# Altium schematic sheet STlink_V3E_PWR.SchDoc: STLINK-V3E SWD Power Module
size A4; Date: Not used; ApprovedBy: Not used; CheckedBy: Not used; Author: Not used; CompanyName: STMicroelectronics; DrawnBy: Not used; Engineer: Not used; Organization: Not used; Address1: Not used; Address2: Not used; Address3: Not used; Address4: Not used; DocumentNumber: Not used; Revision: Not used; SheetNumber: 18; SheetTotal: 19; CurrentTime: Not used; CurrentDate: Not used; Time: Not used; DocumentFullPathAndName: Not used; DocumentName: Not used; ModifiedDate: Not used; ImagePath: Not used; ProjectName: Not used; Application_BuildNumber: Not used
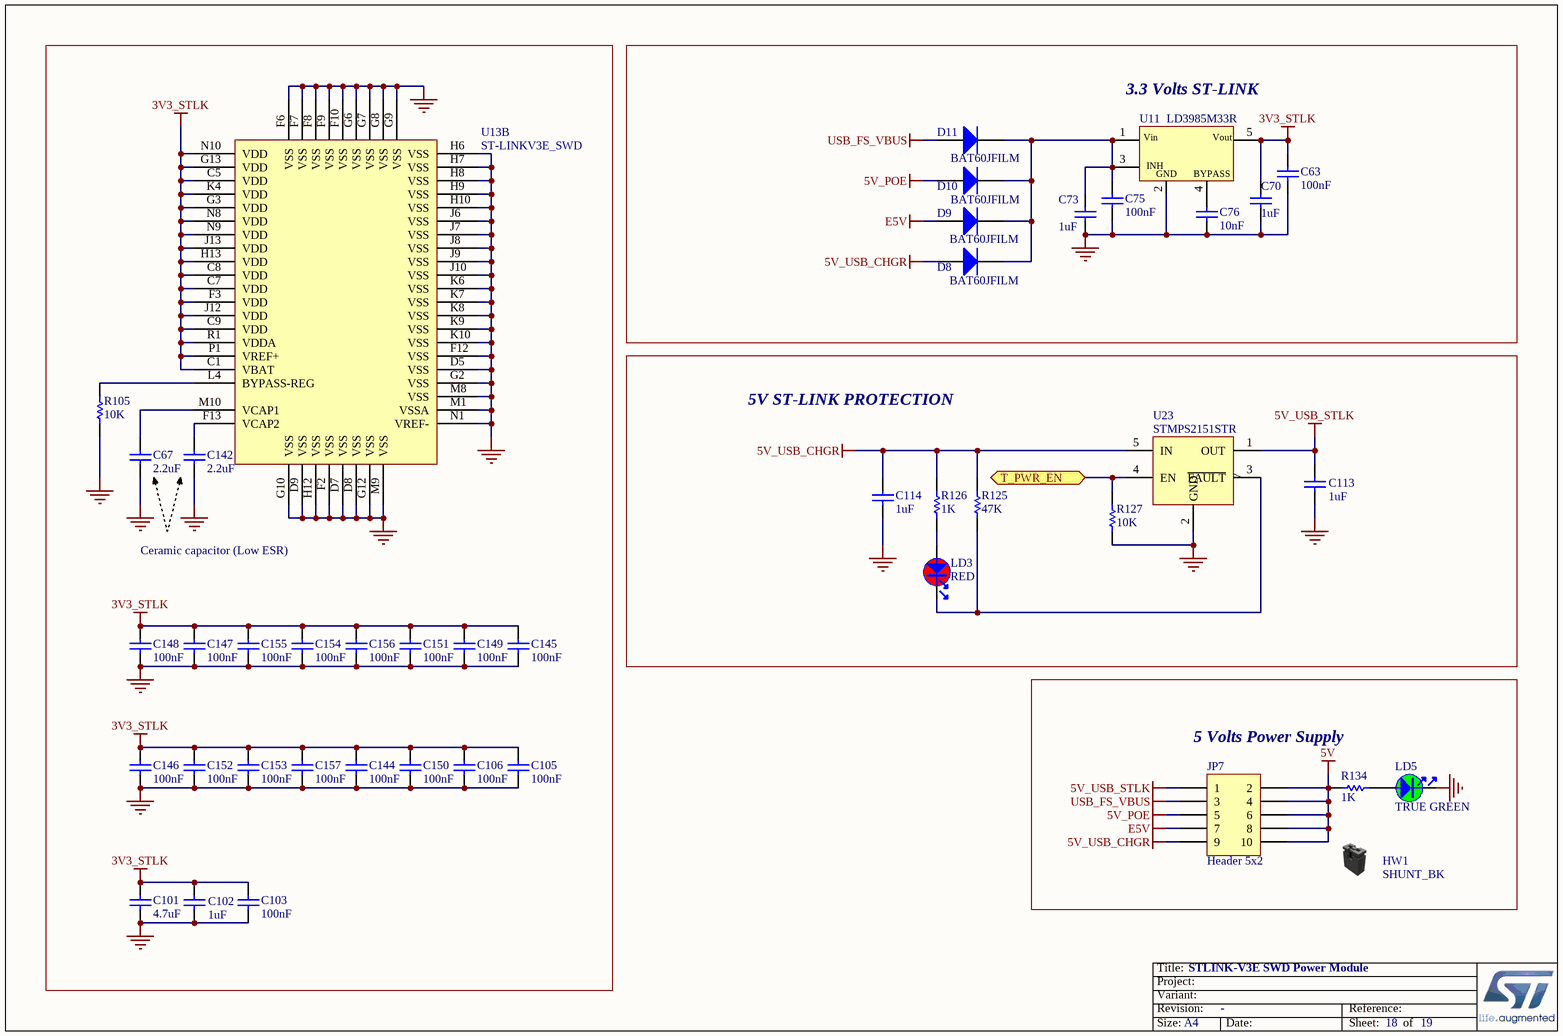
[diagram p0: STlink_V3E_PWR.SchDoc]

## Parts
C63  value 100nF  [C0402]  (hidden comment: Capacitor)
C67  value 2.2uF  [C1206_H1P15]  (hidden comment: Capacitor)
C70  value 1uF  [C0603]  (hidden comment: Capacitor)
C73  value 1uF  [C0603]  (hidden comment: Capacitor)
C75  value 100nF  [C0402]  (hidden comment: Capacitor)
C76  value 10nF  [C0402]  (hidden comment: Capacitor)
C101  value 4.7uF  [C0603]  (hidden comment: Capacitor)
C102  value 1uF  [C0603]  (hidden comment: Capacitor)
C103  value 100nF  [C0402]  (hidden comment: Capacitor)
C105  value 100nF  [C0402]  (hidden comment: Capacitor)
C106  value 100nF  [C0402]  (hidden comment: Capacitor)
C113  value 1uF  [C0603]  (hidden comment: Capacitor)
C114  value 1uF  [C0603]  (hidden comment: Capacitor)
C142  value 2.2uF  [C1206_H1P15]  (hidden comment: Capacitor)
C144  value 100nF  [C0402]  (hidden comment: Capacitor)
C145  value 100nF  [C0402]  (hidden comment: Capacitor)
C146  value 100nF  [C0402]  (hidden comment: Capacitor)
C147  value 100nF  [C0402]  (hidden comment: Capacitor)
C148  value 100nF  [C0402]  (hidden comment: Capacitor)
C149  value 100nF  [C0402]  (hidden comment: Capacitor)
C150  value 100nF  [C0402]  (hidden comment: Capacitor)
C151  value 100nF  [C0402]  (hidden comment: Capacitor)
C152  value 100nF  [C0402]  (hidden comment: Capacitor)
C153  value 100nF  [C0402]  (hidden comment: Capacitor)
C154  value 100nF  [C0402]  (hidden comment: Capacitor)
C155  value 100nF  [C0402]  (hidden comment: Capacitor)
C156  value 100nF  [C0402]  (hidden comment: Capacitor)
C157  value 100nF  [C0402]  (hidden comment: Capacitor)
D8  BAT60JFILM  [DIO_SOD323]
D9  BAT60JFILM  [DIO_SOD323]
D10  BAT60JFILM  [DIO_SOD323]
D11  BAT60JFILM  [DIO_SOD323]
HW1  value SHUNT_BK  [NA]  (hidden comment: Shunt Black 2.54mm)  (mechanical)
JP7  Header 5x2  [CON_988-JIUBABA_PHFS25-12-10-G0B115-T-1]
LD3  value RED  [LED_0603_VISHAY_VLMS1300-GS08_RED_1A2K_H0P8]  (hidden comment: LED_red)
LD5  value TRUE GREEN  [LED_0603_VISHAY_VLMTG1300-GS08_GREEN_1A2K_H0P8]  (hidden comment: LED_green)
R105  value 10K  [R0402]  (hidden comment: Resistor)
R125  value 47K  [R0402]  (hidden comment: Resistor)
R126  value 1K  [R0402]  (hidden comment: Resistor)
R127  value 10K  [R0402]  (hidden comment: Resistor)
R134  value 1K  [R0603]  (hidden comment: Resistor)
U11  LD3985M33R  [REG_SOT23-5L]
U13  ST-LINKV3E_SWD  [ICC_UFBGA201_176+25_10X10_P065]  (part B of 2)
U23  STMPS2151STR  [MOS_SOT23-5L]

## Blocks framed on the sheet
Ceramic capacitor (Low ESR): C67 C101-C103 C105 C106 C142 C144-C157 R105 U13
3.3 Volts ST-LINK: C63 C70 C73 C75 C76 D8-D11 U11
5V ST-LINK PROTECTION: C113 C114 LD3 R125-R127 U23
5 Volts Power Supply: HW1 JP7 LD5 R134

## Ports
T_PWR_EN

## Nets
3V3_STLK: C63.2 C70.2 C101.2 C102.2 C103.2 C105.2 C106.2 C144.2 C145.2 C146.2 C147.2 C148.2 C149.2 C150.2 C151.2 C152.2 C153.2 C154.2 C155.2 C156.2 C157.2 U11.5(Vout) U13.C1(VBAT) U13.C5(VDD) U13.C7(VDD) U13.C8(VDD) U13.C9(VDD) U13.F3(VDD) U13.G3(VDD) U13.G13(VDD) U13.H13(VDD) U13.J12(VDD) U13.J13(VDD) U13.K4(VDD) U13.N8(VDD) U13.N9(VDD) U13.N10(VDD) U13.P1(VREF+) U13.R1(VDDA)
5V: JP7.2 JP7.4 JP7.6 JP7.8 JP7.10 R134.1
5V_POE: D10.1(A) JP7.5
5V_USB_CHGR: C114.2 D8.1(A) JP7.9 R125.2 R126.2 U23.5(IN)
5V_USB_STLK: C113.2 JP7.1 U23.1(OUT)
E5V: D9.1(A) JP7.7
GND: C63.1 C67.1 C70.1 C73.2 C75.1 C76.1 C101.1 C102.1 C103.1 C105.1 C106.1 C113.1 C114.1 C142.1 C144.1 C145.1 C146.1 C147.1 C148.1 C149.1 C150.1 C151.1 C152.1 C153.1 C154.1 C155.1 C156.1 C157.1 LD5.2 R105.1 R127.2 U11.2(GND) U13.D5(VSS) U13.D7(VSS) U13.D8(VSS) U13.D9(VSS) U13.F2(VSS) U13.F6(VSS) U13.F7(VSS) U13.F8(VSS) U13.F9(VSS) U13.F10(VSS) U13.F12(VSS) U13.G2(VSS) U13.G6(VSS) U13.G7(VSS) U13.G8(VSS) U13.G9(VSS) U13.G10(VSS) U13.G12(VSS) U13.H6(VSS) U13.H7(VSS) U13.H8(VSS) U13.H9(VSS) U13.H10(VSS) U13.H12(VSS) U13.J6(VSS) U13.J7(VSS) U13.J8(VSS) U13.J9(VSS) U13.J10(VSS) U13.K6(VSS) U13.K7(VSS) U13.K8(VSS) U13.K9(VSS) U13.K10(VSS) U13.M1(VSSA) U13.M8(VSS) U13.M9(VSS) U13.N1(VREF-) U23.2(GND)
USB_FS_VBUS: D11.1(A) JP7.3
T_PWR_EN: R127.1 U23.4(EN) ; port T_PWR_EN
NetC67_2: C67.2 U13.M10(VCAP1)
NetC73_1: C73.1 C75.2 D8.2(K) D9.2(K) D10.2(K) D11.2(K) U11.1(Vin) U11.3(CE)
NetC76_2: C76.2 U11.4(BYPASS)
NetC142_2: C142.2 U13.F13(VCAP2)
NetLD3_1: LD3.1 R126.1
NetLD3_2: LD3.2 R125.1 U23.3(~{FAULT})
NetLD5_1: LD5.1 R134.2
NetR105_2: R105.2 U13.L4(BYPASS-REG)

## Notes on the sheet
- Title:
- Project:
- Size:
- Revision:
- Variant:
- A4
- -
- Date:
- Reference:
- Sheet:
- of
- (in symbol MCD-00086) INH

## Library data of the parts
C63 C75 C103 C105 C106 C144-C157 = MCD-00102: Capacitor, MLCC, 100nF, 16V, X7R, 10%, 0402, T=0,5mm; Manufacturer_Part_Number: CC0402KRX7R7BB104; Manufacturer: YAGEO; Alternate_Manufacturer_Part_Number: GCM155R71C104KA55D; Alternate_Manufacturer: MURATA; Provided_By: SUBCO; Internal_Part_Number: MCD-00102; Status: Released; Package: C0402; ComponentLink1Description: Datasheet; Part_Type: Capacitor; ComponentLink1URL: http://tunmcdsvn.tun.st.com/Component_Datasheet_Library/Trunk/Capacitors/Yageo_Multilayer_Capacitor_X7R_series_100pF_to_22uF
C67 C142 = MCD-00008: Capacitor, MLCC, 2.2uF, 16V, X7R, 10%, 1206, T=1,15mm; Manufacturer_Part_Number: CC1206KKX7R7BB225; Manufacturer: YAGEO; Alternate_Manufacturer_Part_Number: C1206C225K4RAC; Alternate_Manufacturer: KEMET; Provided_By: SUBCO; Internal_Part_Number: MCD-00008; Status: Released; Part_Type: Capacitor; Package: C1206; ComponentLink1Description: Datasheet; ComponentLink1URL: http://tunmcdsvn.tun.st.com/Component_Datasheet_Library/Trunk/Capacitors/Yageo_Multilayer_Capacitor_X7R_series_100pF_to_22uF
C70 C102 C113 C114 = MCD-00010: Capacitor, MLCC, 1uF, 16V, X5R, 10%, 0603, T=0,8mm; Manufacturer_Part_Number: CC0603KRX5R7BB105; Manufacturer: YAGEO; Provided_By: SUBCO; Internal_Part_Number: MCD-00010; Status: Released; Package: C0603; ComponentLink1Description: Datasheet; Part_Type: Capacitor; ComponentLink1URL: http://tunmcdsvn.tun.st.com/Component_Datasheet_Library/Trunk/Capacitors/Yageo_Multilayer_capacitor_X5R_series_100pF_to_100uF
C73 = MCD-00238: Capacitor, MLCC, 1uF, 6V3, X5R, 10%, 0603, T=0,8mm; Manufacturer_Part_Number: CC0603KRX5R5BB105; Manufacturer: YAGEO; Provided_By: SUBCO; Internal_Part_Number: MCD-00238; Status: Released; Part_Type: Capacitor; Package: C0603; ComponentLink1Description: Datasheet; ComponentLink1URL: http://tunmcdsvn.tun.st.com/Component_Datasheet_Library/Trunk/Capacitors/Yageo_Multilayer_capacitor_X5R_series_100pF_to_100uF
C76 = MCD-00011: Capacitor, MLCC, 10nF, 16V, X7R, 10%, 0402, T=0.5mm; Manufacturer_Part_Number: CC0402KRX7R7BB103; Manufacturer: YAGEO; Provided_By: SUBCO; Internal_Part_Number: MCD-00011; Status: Released; Part_Type: Capacitor; Package: C0402; ComponentLink1Description: Datasheet; ComponentLink1URL: http://tunmcdsvn.tun.st.com/Component_Datasheet_Library/Trunk/Capacitors/Yageo_Multilayer_Capacitor_X7R_series_100pF_to_22uF
C101 = MCD-00009: Capacitor, MLCC, 4.7uF, 16V, X5R, 10%, 0603, T=0.8mm; Manufacturer_Part_Number: CC0603KRX5R7BB475; Manufacturer: YAGEO; Provided_By: SUBCO; Internal_Part_Number: MCD-00009; Status: Released; Part_Type: Capacitor; Package: C0603; ComponentLink1Description: Datasheet; ComponentLink1URL: http://tunmcdsvn.tun.st.com/Component_Datasheet_Library/Trunk/Capacitors/Yageo_Multilayer_capacitor_X5R_series_100pF_to_100uF
D8-D11 = MCD-00034: Manufacturer: STMICROELECTRONICS; Part_Type: Diode; BMS_Part_Number: 9151097; Provided_By: SUBCO with ST control; Internal_Part_Number: MCD-00034; Value: BAT60JFILM; Status: Released; Manufacturer_Part_Number: BAT60JFILM; ComponentLink1Description: Datasheet; ComponentLink1URL: http://tunmcdsvn.tun.st.com/Component_Datasheet_Library/Trunk/Diodes/STM_Diode_BAT60JFILM-SOD323
HW1 = MCD-00122: SHUNT, 2.54mm, height 6.10mm, BLACK; Manufacturer_Part_Number: SNT-100-BK-G; Manufacturer: SAMTEC; Part_Type: Connector; Provided_By: SUBCO; Internal_Part_Number: MCD-00122; Status: Released; ComponentLink1Description: Datasheet; ComponentLink1URL: http://tunmcdsvn.tun.st.com/Component_Datasheet_Library/Trunk/Connectors/Samtec_Shunt_Jumper_SNT100
JP7 = MCD-00312: Header, 5x2, 2.54mm, VR, TH, Height 6mm/3mm; Part_Type: Connector; Manufacturer_Part_Number: PHFS25-12-10-G0B115-T-1; Manufacturer: JIUBABA; Provided_By: SUBCO; Internal_Part_Number: MCD-00312; Value: Header 5x2; Status: Released; ComponentLink1Description: Datasheet; ComponentLink1URL: http://tunmcdsvn.tun.st.com/Component_Datasheet_Library/Trunk/Connectors/Jiubaba_PHFS25_12XXXXXXXXX1; ECCN_US: n/a; ECCN_EU: n/a
LD3 = MCD-00587: LED Red, 0603 SMD, 2V Forward Voltage; Part_Type: Display; Manufacturer_Part_Number: VLMS1300-GS08; Manufacturer: VISHAY; Alternate_Manufacturer_Part_Number: LS Q976-NR-1; Alternate_Manufacturer: OSRAM OPTO SEMICONDUCTORS; Provided_By: SUBCO; Internal_Part_Number: MCD-00587; Status: Released; Package: LED 0603; ComponentLink1Description: Datasheet; ComponentLink1URL: http://tunmcdsvn.tun.st.com/Component_Datasheet_Library/Trunk/Display/VISHAY_LED_RED_VLMS1300-GS08; Order_Code_Digikey: VLMS1300-GS08CT-ND; Order_Code_Farnell: 2078728
LD5 = MCD-00589: LED Green, 0603 SMD, Fw Voltage = 2.8V - 3.6V; Part_Type: Display; Manufacturer_Part_Number: VLMTG1300-GS08; Manufacturer: VISHAY; Alternate_Manufacturer_Part_Number: LG Q396-PS-35; Alternate_Manufacturer: OSRAM OPTO SEMICONDUCTORS; Order_Code_RS: 7730452; Provided_By: SUBCO; Internal_Part_Number: MCD-00589; Status: Checked; Package: LED 0603; ComponentLink1Description: Datasheet; ComponentLink1URL: http://tunmcdsvn.tun.st.com/Component_Datasheet_Library/Trunk/Display/VISHAY_LED_GREEN_VLMTG1300-GS08; Order_Code_Digikey: VLMTG1300-GS08CT-ND; Order_Code_Farnell: 2251490
R105 R127 = MCD-00053: Resistor,10K,0402,1%,1/16W; Manufacturer_Part_Number: RC0402FR-0710KL; Manufacturer: YAGEO; Provided_By: SUBCO; Internal_Part_Number: MCD-00053; Status: Released; ComponentLink1Description: Datasheet; Part_Type: Resistor; Package: R0402; ComponentLink1URL: http://tunmcdsvn.tun.st.com/Component_Datasheet_Library/Trunk/Resistors/Yageo_Resistor_RC0402-series
R125 = MCD-00063: Resistor,47K,0402,1%,1/16W; Manufacturer_Part_Number: RC0402FR-0747KL; Manufacturer: YAGEO; Provided_By: SUBCO; Internal_Part_Number: MCD-00063; Status: Released; ComponentLink1Description: Datasheet; Part_Type: Resistor; Package: R0402; ComponentLink1URL: http://tunmcdsvn.tun.st.com/Component_Datasheet_Library/Trunk/Resistors/Yageo_Resistor_RC0402-series
R126 = MCD-00061: Resistor,1K,0402,1%,1/16W; Manufacturer_Part_Number: RC0402FR-071KL; Manufacturer: YAGEO; Provided_By: SUBCO; Internal_Part_Number: MCD-00061; Status: Released; ComponentLink1Description: Datasheet; Part_Type: Resistor; Package: R0402; ComponentLink1URL: http://tunmcdsvn.tun.st.com/Component_Datasheet_Library/Trunk/Resistors/Yageo_Resistor_RC0402-series
R134 = MCD-00070: Resistor,1K,0603,1%,1/10W; Manufacturer_Part_Number: RC0603FR-071KL; Manufacturer: YAGEO; Provided_By: SUBCO; Internal_Part_Number: MCD-00070; Status: Released; ComponentLink1Description: Datasheet; Part_Type: Resistor; Package: R0603; ComponentLink1URL: http://tunmcdsvn.tun.st.com/Component_Datasheet_Library/Trunk/Resistors/Yageo_Resistor_RC0603-series
U11 = MCD-00086: Ultra low drop-low noise BiCMOS voltage, regulators low ESR capacitors compatible; Manufacturer: STMICROELECTRONICS; Part_Type: IC; BMS_Part_Number: 9176161; Provided_By: SUBCO with ST control; Internal_Part_Number: MCD-00086; Value: LD3985M33R; Status: Released; Manufacturer_Part_Number: LD3985M33R; ComponentLink1Description: Datasheet; ComponentLink1URL: http://tunmcdsvn.tun.st.com/Component_Datasheet_Library/Trunk/IC/STM_LDO_LD3985
U13 = MCD-00596: STM32F723IEK  (STM32F7) BGA176; Part_Type: IC; Manufacturer_Part_Number: STM32F723IEK6; Manufacturer: STMICROELECTRONICS; BMS_Part_Number: 9175300; Provided_By: SUBCO with ST control; Internal_Part_Number: MCD-00596; Value: ST-LINKV3E_SWD; Status: Released; ComponentLink1Description: Datasheet; ComponentLink1URL: http://tunmcdsvn.tun.st.com/Component_Datasheet_Library/Trunk/IC/BGA176+25L_10x10x0.6_pitch0.65
U23 = MCD-00159: 500mA, Enhanced single channel power switches with active high enable pin; Part_Type: IC; Manufacturer: STMICROELECTRONICS; Alternate_Manufacturer_Part_Number: TPS2051C; Alternate_Manufacturer: TEXAS INSTRUMENTS; BMS_Part_Number: 9159009; Provided_By: SUBCO with ST control; Internal_Part_Number: MCD-00159; Value: STMPS2151STR; Status: Released; Manufacturer_Part_Number: STMPS2151STR; ComponentLink1Description: Datasheet; ComponentLink1URL: http://tunmcdsvn.tun.st.com/Component_Datasheet_Library/Trunk/IC/STM_PWR-Switch_STMPS2151STR